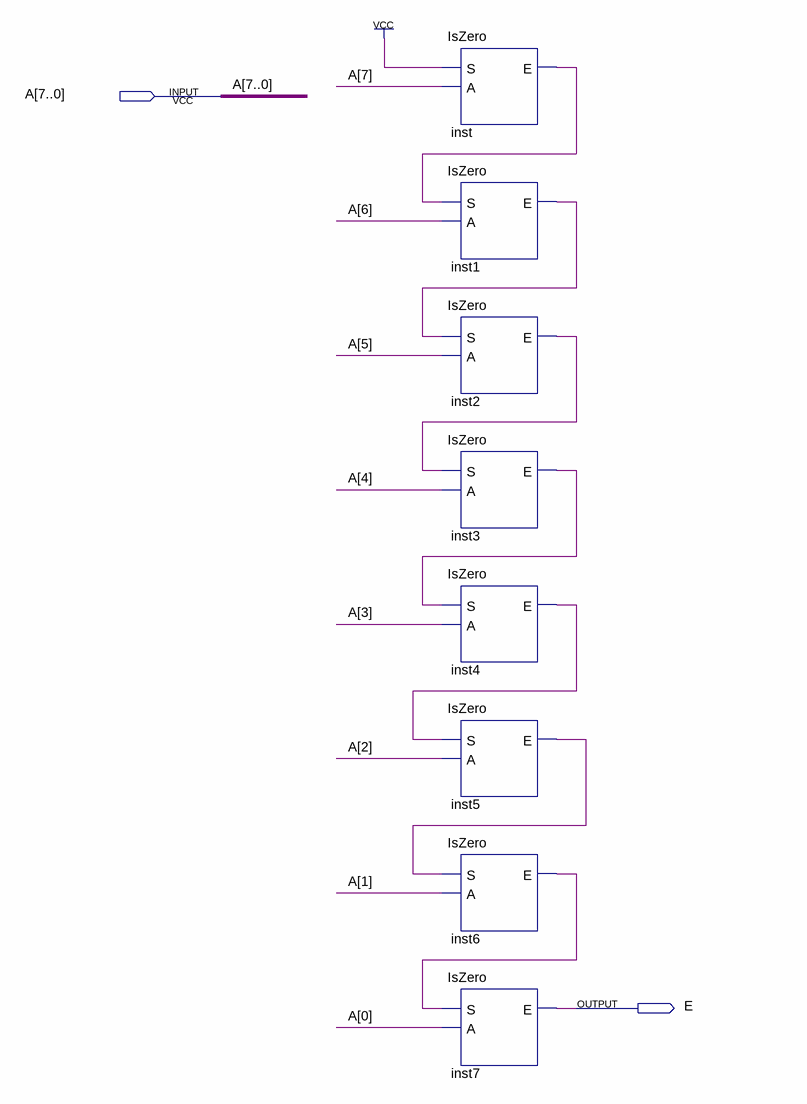
[diagram p0: schematic sheet]
// Quartus schematic IsZero8.bdf as structural Verilog: 8 symbols, 2 pins
module IsZero8 (
  input  [7:0] A,
  output E
);

  wire inst1_e, inst2_e, inst3_e, inst4_e, inst5_e, inst6_e, inst_e;

  IsZero inst (.S(1'b1), .A(A[7]), .E(inst_e));
  IsZero inst1 (.S(inst_e), .A(A[6]), .E(inst1_e));
  IsZero inst2 (.S(inst1_e), .A(A[5]), .E(inst2_e));
  IsZero inst3 (.S(inst2_e), .A(A[4]), .E(inst3_e));
  IsZero inst4 (.S(inst3_e), .A(A[3]), .E(inst4_e));
  IsZero inst5 (.S(inst4_e), .A(A[2]), .E(inst5_e));
  IsZero inst6 (.S(inst5_e), .A(A[1]), .E(inst6_e));
  IsZero inst7 (.S(inst6_e), .A(A[0]), .E(E));
endmodule
